# Altium schematic sheet Memory-SD_UHS_II.SchDoc
size A3; SheetNumber: 32; SheetTotal: 32
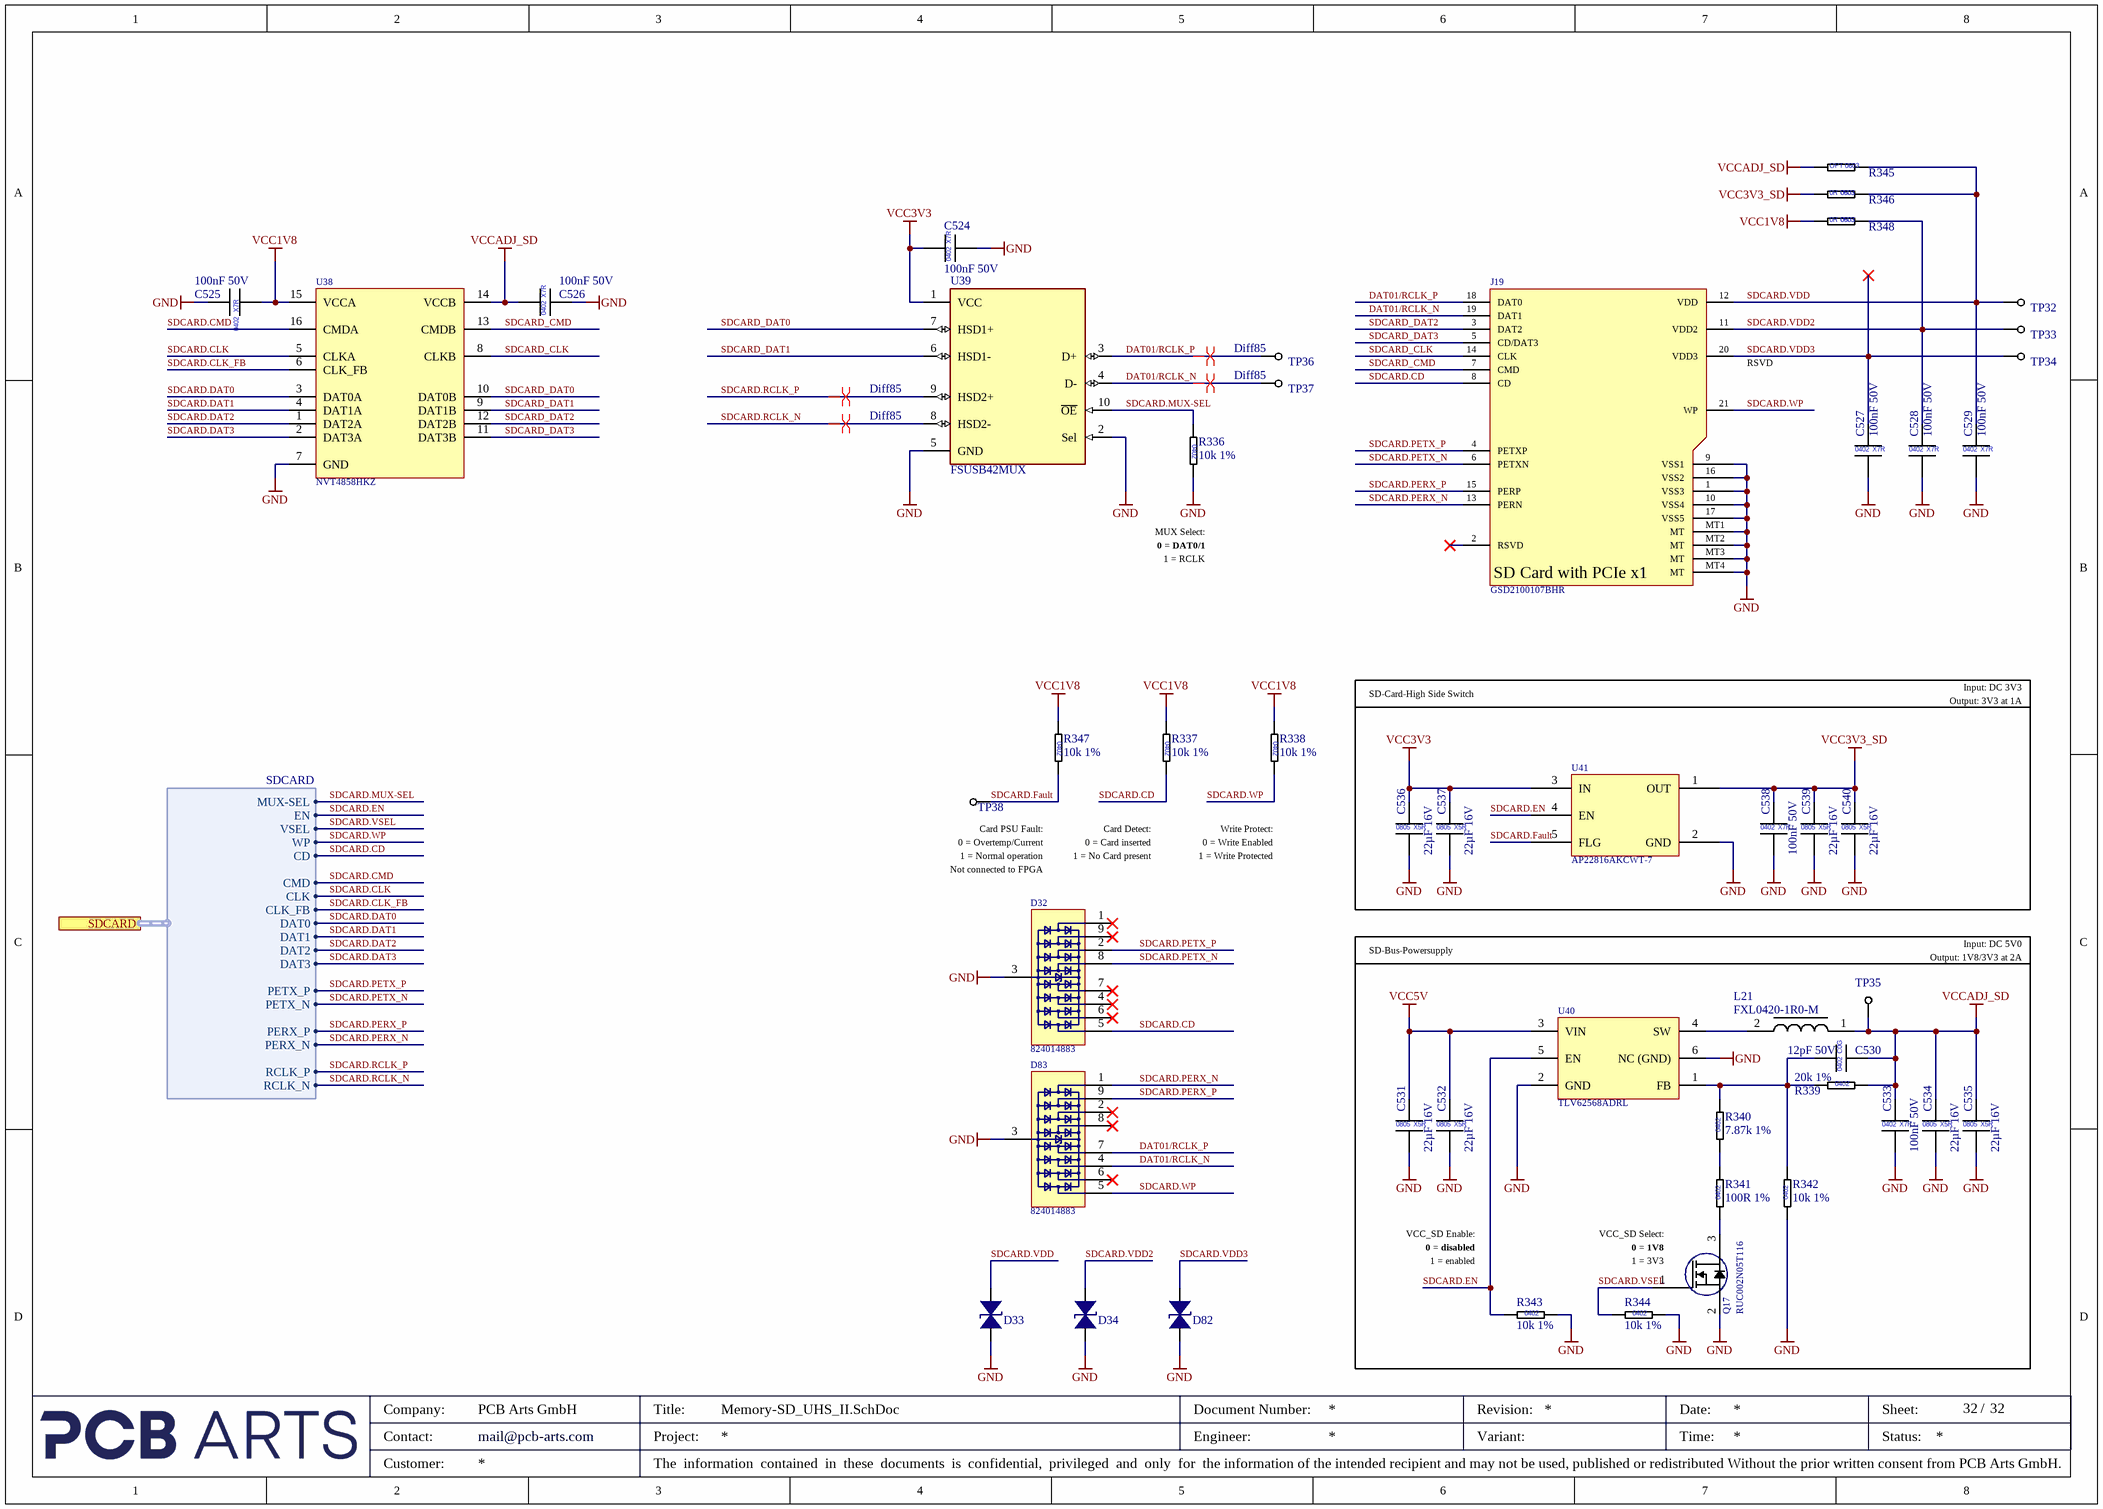
[diagram p0: Memory-SD_UHS_II.SchDoc]

## Parts
C524  100nF 50V  [CAP_0402_L]
C525  100nF 50V  [CAP_0402_L]
C526  100nF 50V  [CAP_0402_L]
C527  100nF 50V  [CAP_0402_L]
C528  100nF 50V  [CAP_0402_L]
C529  100nF 50V  [CAP_0402_L]
C530  12pF 50V  [CAP_0402_L]
C531  22µF 16V  [CAP_0805]
C532  22µF 16V  [CAP_0805]
C533  100nF 50V  [CAP_0402_L]
C534  22µF 16V  [CAP_0805]
C535  22µF 16V  [CAP_0805]
C536  22µF 16V  [CAP_0805]
C537  22µF 16V  [CAP_0805]
C538  100nF 50V  [CAP_0402_L]
C539  22µF 16V  [CAP_0805]
C540  22µF 16V  [CAP_0805]
D32  824014883  [WE-TVS-DFN3810-9L]
D33  CESDP0402UC5VB  [TVS_0402]  (value not drawn)
D34  CESDP0402UC5VB  [TVS_0402]  (value not drawn)
D82  CESDP0402UC5VB  [TVS_0402]  (value not drawn)
D83  824014883  [WE-TVS-DFN3810-9L]
J19  Symbol Text: GSD2100107BHR  [Amphenol_GSD2100107BHR]  (hidden comment: Amphenol / GSD2100107BHR / SD-Card UHS-II / Side Entry / Push-Push)
L21  FXL0420-1R0-M  [FXL0420-1R0-M]
Q17  RUC002N05T116  [SOT95P251X112-3N]
R336  10k 1%  [RES_0402_L]
R337  10k 1%  [RES_0402_L]
R338  10k 1%  [RES_0402_L]
R339  20k 1%  [RES_0402_L]
R340  7.87k 1%  [RES_0402_L]
R341  100R 1%  [RES_0402_L]
R342  10k 1%  [RES_0402_L]
R343  10k 1%  [RES_0402_L]
R344  10k 1%  [RES_0402_L]
R345  OPT  [RES_0603_L]  (value not drawn)  (no BOM)
R346  0R Jumper  [RES_0603_L]  (value not drawn)
R347  10k 1%  [RES_0402_L]
R348  0R Jumper  [RES_0603_L]  (value not drawn)
TP32  Testpoint  [Testpoint 0.8mm]  (value not drawn)  (no BOM)
TP33  Testpoint  [Testpoint 0.8mm]  (value not drawn)  (no BOM)
TP34  Testpoint  [Testpoint 0.8mm]  (value not drawn)  (no BOM)
TP35  Testpoint  [Testpoint 0.8mm]  (value not drawn)  (no BOM)
TP36  Testpoint  [Testpoint 0.8mm]  (value not drawn)  (no BOM)
TP37  Testpoint  [Testpoint 0.8mm]  (value not drawn)  (no BOM)
TP38  Testpoint  [Testpoint 0.8mm]  (value not drawn)  (no BOM)
U38  NVT4858HKZ  [QFN40P180X260X55-16N]
U39  FSUSB42MUX  [SOP50P300X300X110-10N]
U40  TLV62568ADRL  [SON50P150X80-6N]
U41  AP22816AKCWT-7  [SOT95P285X140-5N]

## Ports
SDCARD (harness SDCARD, see Top-Level-Sheet[3B], MGT Banks 115-116[8B], SMI Bank 12[1B])

## Harnesses
SDCARD: MUX-SEL, EN, VSEL, WP, CD, CMD, CLK, CLK_FB, PETX_P, PETX_N, DAT0, DAT1, DAT2, DAT3, PERX_P, PERX_N, RCLK_P, RCLK_N

## Nets
GND: C524.2 C525.2 C526.2 C527.2 C528.2 C529.2 C531.2 C532.2 C533.2 C534.2 C535.2 C536.2 C537.2 C538.2 C539.2 C540.2 D32.3(GND) D33.2 D34.2 D82.2 D83.3(GND) J19.1(VSS3) J19.9(VSS1) J19.10(VSS4) J19.16(VSS2) J19.17(VSS5) J19.MT1(MT) J19.MT2(MT) J19.MT3(MT) J19.MT4(MT) Q17.2(D) R336.2 R342.1 R343.2 R344.2 U38.7(GND) U39.2(Sel) U39.5(GND) U40.2(GND) U40.6(NC_(GND)) U41.2(GND)
VCC1V8: C525.1 R337.1 R338.1 R347.1 R348.1 U38.15(VCCA)
VCC3V3: C524.1 C536.1 C537.1 U39.1(VCC) U41.3(IN)
VCC3V3_SD: C538.1 C539.1 C540.1 R346.1 U41.1(OUT)
VCC5V: C531.1 C532.1 U40.3(VIN)
VCCADJ_SD: C526.1 C530.2 C533.1 C534.1 C535.1 L21.1 R339.2 R345.1 TP35.1(GND) U38.14(VCCB)
DAT01/RCLK_N: D83.4(IO3) J19.19(DAT1) TP37.1(GND) U39.4(D-)
DAT01/RCLK_P: D83.7(IO6) J19.18(DAT0) TP36.1(GND) U39.3(D+)
SDCARD.CD: D32.5(IO4) J19.8(CD) R337.2 ; port SDCARD.CD
SDCARD.CLK: U38.5(CLKA) ; port SDCARD.CLK
SDCARD.CLK_FB: U38.6(CLK_FB) ; port SDCARD.CLK_FB
SDCARD.CMD: U38.16(CMDA) ; port SDCARD.CMD
SDCARD.DAT0: U38.3(DAT0A) ; port SDCARD.DAT0
SDCARD.DAT1: U38.4(DAT1A) ; port SDCARD.DAT1
SDCARD.DAT2: U38.1(DAT2A) ; port SDCARD.DAT2
SDCARD.DAT3: U38.2(DAT3A) ; port SDCARD.DAT3
SDCARD.EN: R343.1 U40.5(EN) U41.4(EN) ; port SDCARD.EN
SDCARD.Fault: R347.2 TP38.1(GND) U41.5(FLG)
SDCARD.MUX-SEL: R336.1 U39.10(~{OE}) ; port SDCARD.MUX-SEL
SDCARD.PERX_N: D83.1(IO1) J19.13(PERN) ; port SDCARD.PERX_N
SDCARD.PERX_P: D83.9(IO8) J19.15(PERP) ; port SDCARD.PERX_P
SDCARD.PETX_N: D32.8(IO7) J19.6(PETXN) ; port SDCARD.PETX_N
SDCARD.PETX_P: D32.2(IO2) J19.4(PETXP) ; port SDCARD.PETX_P
SDCARD.RCLK_N: U39.8(HSD2-) ; port SDCARD.RCLK_N
SDCARD.RCLK_P: U39.9(HSD2+) ; port SDCARD.RCLK_P
SDCARD.VDD: C529.1 D33.1 J19.12(VDD) R345.2 R346.2 TP32.1(GND)
SDCARD.VDD2: C528.1 D34.1 J19.11(VDD2) R348.2 TP33.1(GND)
SDCARD.VDD3: C527.1 D82.1 J19.20(VDD3) TP34.1(GND)
SDCARD.VSEL: Q17.1(G) R344.1 ; port SDCARD.VSEL
SDCARD.WP: D83.5(IO4) J19.21(WP) R338.2 ; port SDCARD.WP
SDCARD_CLK: J19.14(CLK) U38.8(CLKB)
SDCARD_CMD: J19.7(CMD) U38.13(CMDB)
SDCARD_DAT0: U38.10(DAT0B) U39.7(HSD1+)
SDCARD_DAT1: U38.9(DAT1B) U39.6(HSD1-)
SDCARD_DAT2: J19.3(DAT2) U38.12(DAT2B)
SDCARD_DAT3: J19.5(CD/DAT3) U38.11(DAT3B)
NetC530_1: C530.1 R339.1 R340.2 R342.2 U40.1(FB)
NetL21_2: L21.2 U40.4(SW)
NetQ17_3: Q17.3(S) R341.1
NetR340_1: R340.1 R341.2

Not connected (* = marked no-connect by the designer): D32 1(IO1)* 4(IO3)* 6(IO5)* 7(IO6)* 9(IO8)*; D83 2(IO2)* 6(IO5)* 8(IO7)*; J19 2(RSVD)*

## Layout directives
differential pair; net class Diff85: DAT01/RCLK_N, DAT01/RCLK_P, SDCARD.RCLK_N, SDCARD.RCLK_P

## Notes on the sheet
- (near J19) RSVD
- MUX Select:
- 1 = RCLK
- 0 = DAT0/1
- SD-Card-High Side Switch
- Input: DC 3V3
- Output: 3V3 at 1A
- (near TP38) Card PSU Fault:
- 1 = Normal operation
- (near TP38) 0 = Overtemp/Current
- Card Detect:
- 1 = No Card present
- 0 = Card inserted
- Write Protect:
- 1 = Write Protected
- 0 = Write Enabled
- Not connected to FPGA
- SD-Bus-Powersupply
- Input: DC 5V0
- Output: 1V8/3V3 at 2A
- VCC_SD Enable:
- 1 = enabled
- 0 = disabled
- (near Q17) VCC_SD Select:
- (near Q17) 1 = 3V3
- (near Q17) 0 = 1V8
- Company:
- Contact:
- Customer:
- mail@pcb-arts.com
- PCB Arts GmbH
- Title:
- Project:
- The  information  contained  in  these  documents  is  confidential,  privileged  and  only  for  the information of the intended recipient and may not be used, published or redistributed Without the prior written consent from PCB Arts GmbH.
- Engineer:
- Document Number:
- Revision:
- Variant:
- Date:
- Time:
- Sheet:
- Status:
- /
- (in symbol CAP_0402_12pF_50V) C0G; 0402
- (in symbol CAP_0402_100nF_50V) 0402; X7R
- (in symbol CAP_0805_22µF_16V) 0805; X5R
- (in symbol CMP-CON-000076-3) SD Card with PCIe x1
- (in symbol RES_0402_7.87k_1%) 0402
- (in symbol RES_0402_10k_1%) 0402
- (in symbol RES_0402_20k_1%) 0402
- (in symbol RES_0402_100R_1%) 0402
- (in symbol RES_0603_0R_Jumper_1) 0R; 0603
- (in symbol RES_0603_OPT) OPT 0603

## Library data of the parts
C524-C529 C533 C538 = CAP_0402_100nF_50V: Multilayer Ceramic Capacitors MLCC - SMD/SMT 0402 50VDC; Manufacturer 1: Murata Electronics; Manufacturer 1 Prt. Nr.: GCM155L8EH104KE07D; Manufacturer 2 Prt. Nr.: UMK105B7104KV-FR; Manufacturer 2: TDK
C530 = CAP_0402_12pF_50V: Multilayer Ceramic Capacitors MLCC - SMD/SMT 0402 50VDC; Manufacturer 1: Murata Electronics; Manufacturer 1 Prt. Nr.: GCM1555C1H120JA16J; Manufacturer 2 Prt. Nr.: C0402C120J5GACTU; Manufacturer 2: KEMET
C531 C532 C534-C537 C539 C540 = CAP_0805_22µF_16V: Multilayer Ceramic Capacitors MLCC - SMD/SMT 0805 16VDC; Manufacturer 1: Samsung Electro-Mechanics; Manufacturer 1 Prt. Nr.: CL21A226KOQNNNG; Manufacturer 2 Prt. Nr.: GRM21BC81C226ME44K; Manufacturer 2: Murata Electronics
D32 D83 = 824014883_ESD-Suppressors_TVS-Diodes_3.3V_0.5pF_8Chnl: ESD Suppressors / TVS Diodes WE-TVS Diode Array 3.3V 0.5pF 8Channel; Manufacturer 1: Wurth Elektronik; Manufacturer 1 Prt. Nr.: 824014883
D33 D34 D82 = CESDP0402UC5VB_TVS Diode 0402: Low Capacitance ESD Protection Diode 0402; Manufacturer 1: CREATEK; Manufacturer 2 Prt. Nr.: BPESD0402-05ST; Manufacturer 1 Prt. Nr.: CESDP0402UC5VB; Manufacturer 2: BORN
J19 = CMP-CON-000076-3: Horizontal SD Card UHS-II Connector with PCIe x1 Pins, Push-Push operation; Gender: Female; Manufacturer 1 Prt. Nr.: GSD2100107BHR; Manufacturer 1: Amphenol; Value: GSD2100107BHR; Entry Direction: Side Entry; Mount: Surface Mount; Pin Count: 19; Min Operating Temperature: -40°C; Max Operating Temperature: 85°C
L21 = 1uH 6A 27mΩ  FXL0420-1R0-M: 1uH ±20% 6A 27mΩ SMD,4.4x4.5x1.8mm Power Inductor; Manufacturer 1: cjiang(Changjiang Microelectronics Tech); Manufacturer 1 Prt. Nr.: FXL0420-1R0-M
Q17 = RUC002N05T116_MOSFET N-Ch 1.2 VGS Spec: MOSFET N-Ch 1.2 VGS Spec; Manufacturer 1: ROHM Semiconductor; Manufacturer 1 Prt. Nr.: RUC002N05T116
R336-R338 R342-R344 R347 = RES_0402_10k_1%: Thick Film Resistors - SMD 10kOhm 1%; Manufacturer 1: Vishay / Dale; Manufacturer 1 Prt. Nr.: CRCW040210K0FKEDC; Manufacturer 2 Prt. Nr.: RC0402FR-7W10KL; Manufacturer 2: Yageo
R339 = RES_0402_20k_1%: Thick Film Resistors - SMD 20kOhm 1%; Manufacturer 1: Vishay / Dale; Manufacturer 1 Prt. Nr.: CRCW040220K0FKEDC; Manufacturer 2 Prt. Nr.: RC0402FR-7D20KL; Manufacturer 2: Yageo
R340 = RES_0402_7.87k_1%: Thick Film Resistors - SMD 7.87kOhm 1%; Manufacturer 1: Panasonic; Manufacturer 1 Prt. Nr.: ERJ-2RKF7871X; Manufacturer 2 Prt. Nr.: RC0402FR-077K87L; Manufacturer 2: Yageo
R341 = RES_0402_100R_1%: Thick Film Resistors - SMD 100Ohm 1%; Manufacturer 1: Vishay / Dale; Manufacturer 1 Prt. Nr.: CRCW0402100RFKEE; Manufacturer 2 Prt. Nr.: RC0402FR-7W100RL; Manufacturer 2: Yageo
R345 = RES_0603_OPT: Thick Film Resistors - SMD Optional
R346 R348 = RES_0603_0R_Jumper_1: Thick Film Resistors - SMD 0Ohm Jumper; Manufacturer 1: Yageo; Manufacturer 1 Prt. Nr.: RC0603JR-100RL; Manufacturer 2 Prt. Nr.: CRCW06030000Z0EBC; Manufacturer 2: Vishay / Draloric
TP32-TP38 = Testpoint 0.8mm
U38 = NVT4858HKZ_Levelshifter SD 3.0-SDR104, auto-direction, EMI filter and ESD protection: Levelshifter SD 3.0-SDR104, auto-direction, EMI filter and ESD protection; Manufacturer 1: NXP Semiconductors; Manufacturer 1 Prt. Nr.: NVT4858HKZ
U39 = FSUSB42MUX_IC USB SWITCH DPDT: IC USB SWITCH DPDT; Manufacturer 1: onsemi / Fairchild; Manufacturer 1 Prt. Nr.: FSUSB42MUX
U40 = TLV62568ADRL_Step Down Converter 1A; 2A: Step Down Converter with Forced PWM in SOT563 Package; Manufacturer 1: Texas Instruments; Manufacturer 1 Prt. Nr.: TLV62568ADRL
U41 = AP22816AKCWT-7_Power Switch ICs - Power Distribution Load Switch: Power Switch ICs - Power Distribution Load Switch; Manufacturer 1: Diodes Incorporated; Manufacturer 1 Prt. Nr.: AP22816AKCWT-7